# Altium schematic sheet TOP_scheet.SchDoc
size A4; SheetNumber: 1; SheetTotal: 7
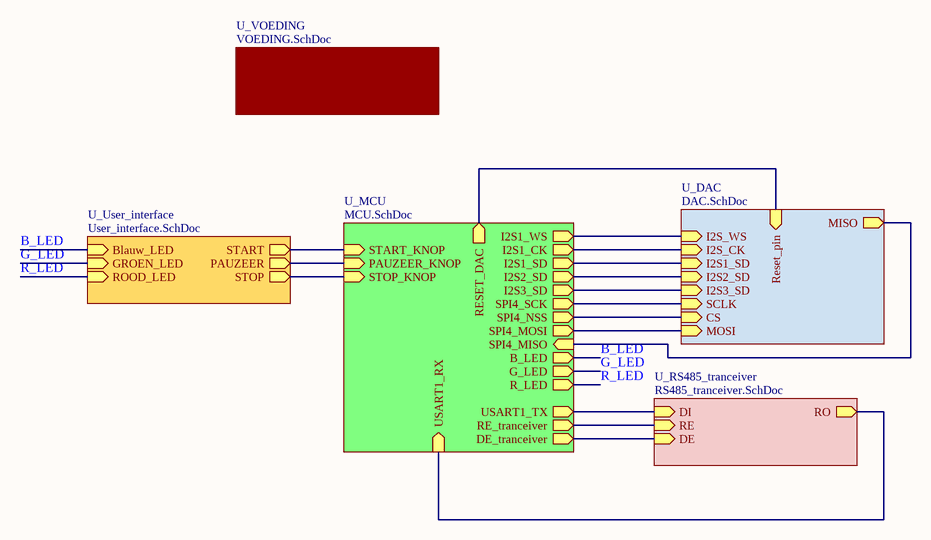
[diagram p0: TOP_scheet.SchDoc]

## Sub-sheets
U_DAC = DAC.SchDoc: Reset_pin (in), CS (in), MOSI (in), MISO (out), SCLK (in), I2S_WS (in), I2S_CK (in), I2S1_SD (in), I2S2_SD (in), I2S3_SD (in)
U_MCU = MCU.SchDoc: I2S1_WS (out), I2S1_CK (out), I2S1_SD (out), I2S2_SD (out), I2S3_SD (out), SPI4_SCK (out), SPI4_NSS (out), SPI4_MOSI (out), SPI4_MISO (in), USART1_TX (out), USART1_RX (in), B_LED (out), G_LED (out), R_LED (out), START_KNOP (in), PAUZEER_KNOP (in), STOP_KNOP (in), RESET_DAC (out), RE_tranceiver (out), DE_tranceiver (out)
U_RS485_tranceiver = RS485_tranceiver.SchDoc: DE (in), RE (in), DI (in), RO (out)
U_User_interface = User_interface.SchDoc: Blauw_LED (in), GROEN_LED (in), ROOD_LED (in), START (out), PAUZEER (out), STOP (out)
U_VOEDING = VOEDING.SchDoc: no entries

## Nets
B_LED: sheet U_User_interface/Blauw_LED, sheet U_MCU/B_LED
G_LED: sheet U_User_interface/GROEN_LED, sheet U_MCU/G_LED
R_LED: sheet U_User_interface/ROOD_LED, sheet U_MCU/R_LED
(unnamed): sheet U_DAC/Reset_pin, sheet U_MCU/RESET_DAC
(unnamed): sheet U_DAC/CS, sheet U_MCU/SPI4_NSS
(unnamed): sheet U_DAC/MOSI, sheet U_MCU/SPI4_MOSI
(unnamed): sheet U_DAC/MISO, sheet U_MCU/SPI4_MISO
(unnamed): sheet U_DAC/SCLK, sheet U_MCU/SPI4_SCK
(unnamed): sheet U_DAC/I2S_WS, sheet U_MCU/I2S1_WS
(unnamed): sheet U_DAC/I2S_CK, sheet U_MCU/I2S1_CK
(unnamed): sheet U_DAC/I2S1_SD, sheet U_MCU/I2S1_SD
(unnamed): sheet U_DAC/I2S2_SD, sheet U_MCU/I2S2_SD
(unnamed): sheet U_DAC/I2S3_SD, sheet U_MCU/I2S3_SD
(unnamed): sheet U_RS485_tranceiver/DE, sheet U_MCU/DE_tranceiver
(unnamed): sheet U_RS485_tranceiver/RE, sheet U_MCU/RE_tranceiver
(unnamed): sheet U_RS485_tranceiver/DI, sheet U_MCU/USART1_TX
(unnamed): sheet U_RS485_tranceiver/RO, sheet U_MCU/USART1_RX
(unnamed): sheet U_User_interface/START, sheet U_MCU/START_KNOP
(unnamed): sheet U_User_interface/PAUZEER, sheet U_MCU/PAUZEER_KNOP
(unnamed): sheet U_User_interface/STOP, sheet U_MCU/STOP_KNOP